# EAGLE design buttonpad (EAGLE 6.0)
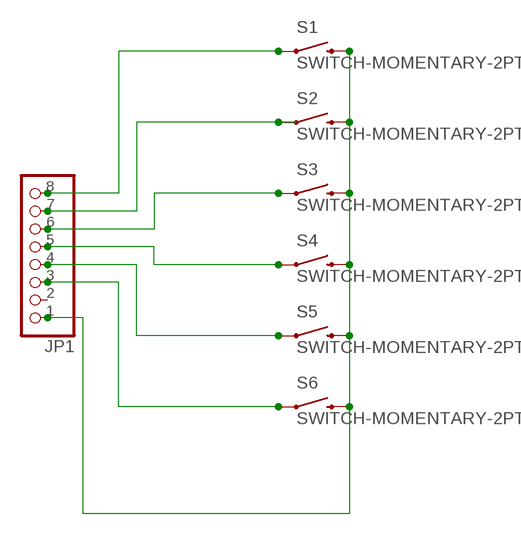
[diagram p0: schematic, sheet 1]

## Parts
JP1  PINHD-1X8  [1X08]
S1  SWITCH-MOMENTARY-2PTH  [TACTILE-PTH]
S2  SWITCH-MOMENTARY-2PTH  [TACTILE-PTH]
S3  SWITCH-MOMENTARY-2PTH  [TACTILE-PTH]
S4  SWITCH-MOMENTARY-2PTH  [TACTILE-PTH]
S5  SWITCH-MOMENTARY-2PTH  [TACTILE-PTH]
S6  SWITCH-MOMENTARY-2PTH  [TACTILE-PTH]

## Nets
GND: JP1.1 S1.3 S2.3 S3.3 S4.3 S5.3 S6.3
N$2: JP1.8 S1.1
N$4: JP1.6 S3.1
N$7: JP1.3 S6.1
N$8: JP1.7 S2.1
N$10: JP1.5 S4.1
N$11: JP1.4 S5.1
Unconnected: JP1.2

## Library data of the parts
JP1 = pinhead:PINHD-1X8: PIN HEADER
S1-S6 = SparkFun:SWITCH-MOMENTARY-2

## Board
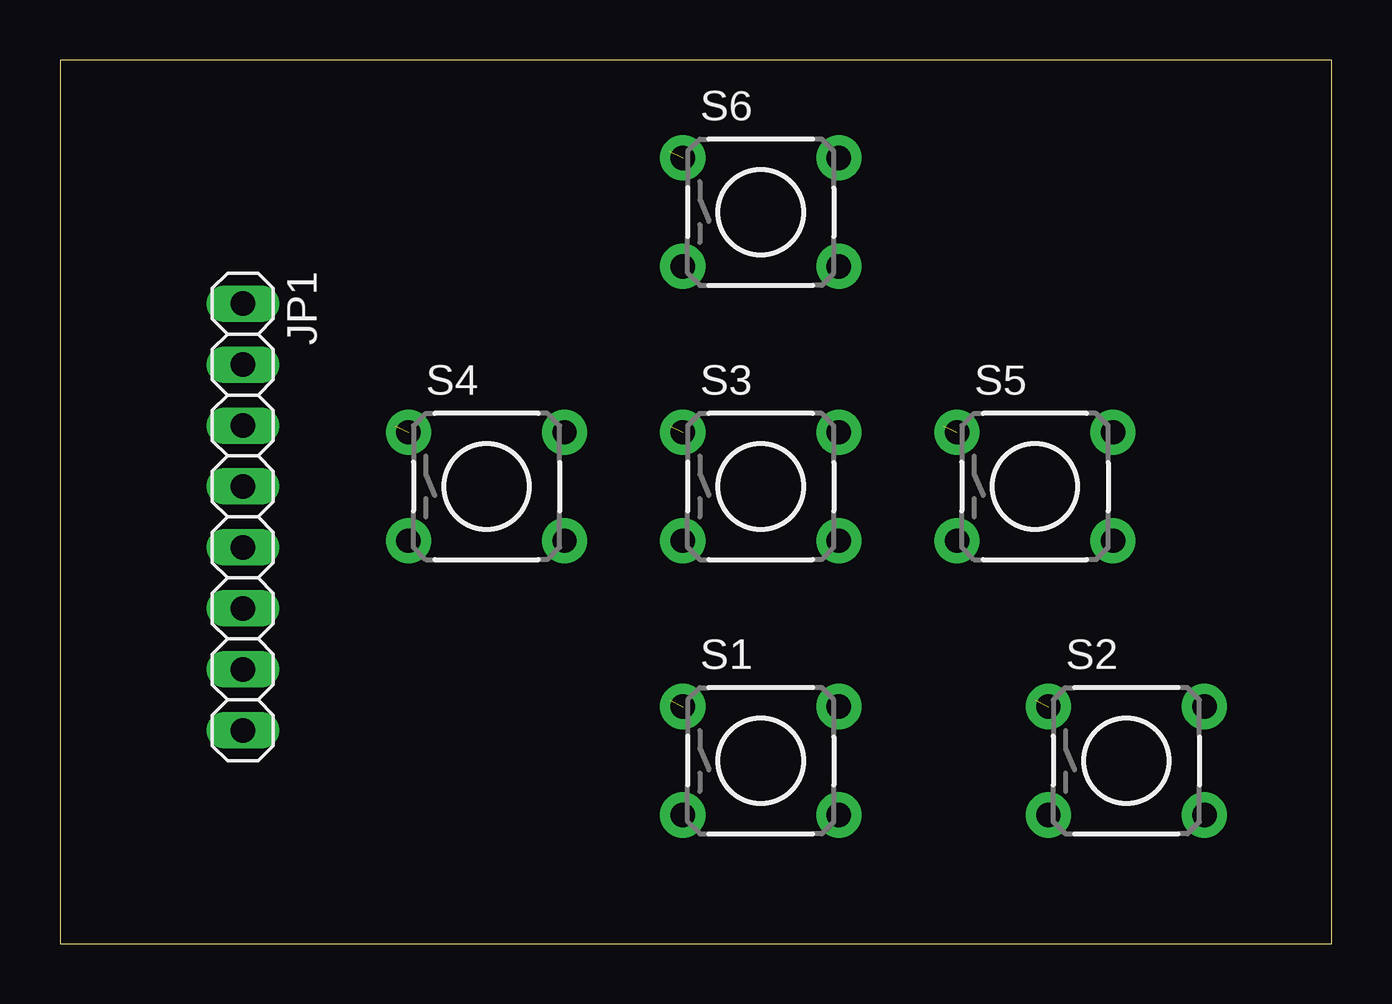
[diagram p1: board, top side]
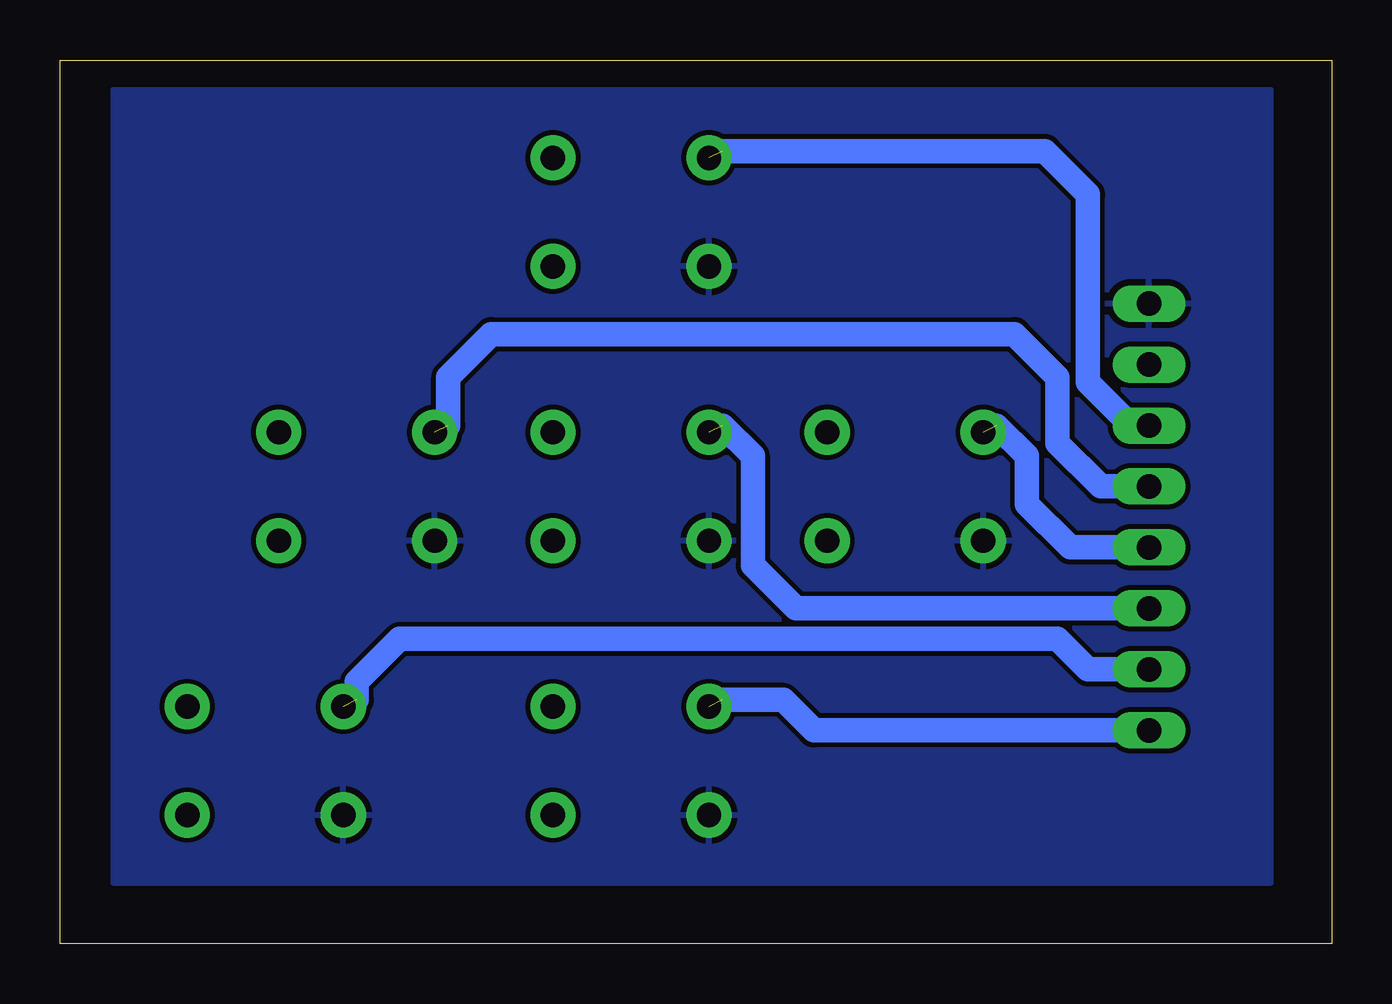
[diagram p2: board, bottom side, seen from below]

Size 53.01 x 36.82 mm. Coordinates in mm from the lower left corner, seen from the top.
Outline: 0,0 53.01,0 53.01,36.82 0,36.82 0,0
Copper layers (1*16): Top 0.035mm / dielectric 1.5mm / Bottom 0.035mm
Design rules: minimum track width 10mil, minimum drill 24mil, track to track 8mil, track to pad 8mil, pad to pad 8mil, via to via 8mil, smd to smd 8mil, copper to edge 40mil, drill to drill 8mil, minimum pad ring 10mil, minimum via ring 8mil, stop-mask expansion 4mil, vias tented up to drill 0mil, thermal gap 10mil

### Footprints (pad centres in the part's own frame; a part is rotated, then mirrored left to right if it is on the bottom)
1X08 = drill 1.016 long: 1 -8.89,0; 2 -6.35,0; 3 -3.81,0; 4 -1.27,0; 5 1.27,0; 6 3.81,0; 7 6.35,0; 8 8.89,0
TACTILE-PTH = drill 1.016 pad 1.88: 1 -3.251,2.261; 2 3.251,2.261; 3 -3.251,-2.261; 4 3.251,-2.261

### Placement (x,y rotation side)
JP1  7.62,17.78 270 top
S1  29.21,7.62 0 top
S2  44.45,7.62 0 top
S3  29.21,19.05 0 top
S4  17.78,19.05 0 top
S5  40.64,19.05 0 top
S6  29.21,30.48 0 top

### Tracks (layer width: path | path; a pad name or v marks a point on that pad's centre or on a via)
GND
  pour Bottom: 2.54,35.56 50.8,35.56 50.8,33.02 50.8,2.54 2.54,2.54
N$2  (1 unrouted)
  Bottom 1.016: JP1.8 21.59,8.89 22.86,10.16 25.4,10.16
N$4  (1 unrouted)
  Bottom 1.016: 25.4,21.59 24.13,20.32 24.13,15.77 22.33,13.97 JP1.6
N$7  (1 unrouted)
  Bottom 1.016: JP1.3 8.36,21.59 10.16,23.39 10.16,31.22 11.96,33.02 25.4,33.02
N$8  (1 unrouted)
  Bottom 1.016: 40.64,10.16 40.64,10.9 38.84,12.7 11.43,12.7 10.16,11.43 JP1.7
N$10  (1 unrouted)
  Bottom 1.016: 13.97,21.59 12.7,20.32 12.7,18.31 10.9,16.51 JP1.5
N$11  (1 unrouted)
  Bottom 1.016: 36.83,21.59 36.83,23.6 35.03,25.4 13.23,25.4 11.43,23.6 11.43,20.85 9.63,19.05 JP1.4